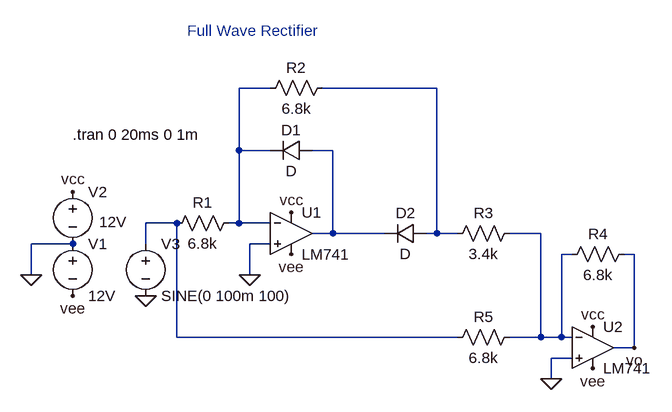
[diagram p0: schematic full_wave_rectifier.asc]
full_wave_rectifier.asc, the LTspice schematic file:
Version 4.1
SHEET 1 916 680
WIRE 320 -64 272 -64
WIRE 576 -64 400 -64
WIRE 272 32 272 -64
WIRE 320 32 272 32
WIRE 416 32 384 32
WIRE 176 144 128 144
WIRE 272 144 272 32
WIRE 272 144 256 144
WIRE 320 144 272 144
WIRE 416 160 416 32
WIRE 416 160 384 160
WIRE 496 160 416 160
WIRE 576 160 576 -64
WIRE 576 160 560 160
WIRE 608 160 576 160
WIRE 736 160 688 160
WIRE 16 176 -48 176
WIRE 128 176 128 144
WIRE 320 176 288 176
WIRE 784 192 768 192
WIRE 880 192 864 192
WIRE -48 224 -48 176
WIRE 288 224 288 176
WIRE 176 320 176 144
WIRE 608 320 176 320
WIRE 736 320 736 160
WIRE 736 320 688 320
WIRE 768 320 768 192
WIRE 768 320 736 320
WIRE 784 320 768 320
WIRE 880 336 880 192
WIRE 880 336 848 336
WIRE 784 352 752 352
WIRE 752 384 752 352
FLAG -48 224 0
FLAG 16 96 vcc
FLAG 16 256 vee
FLAG 752 384 0
FLAG 128 256 0
FLAG 880 336 vo
FLAG 288 224 0
FLAG 352 128 vcc
FLAG 352 192 vee
FLAG 816 304 vcc
FLAG 816 368 vee
SYMBOL voltage 16 160 R0
WINDOW 123 0 0 Left 0
WINDOW 39 0 0 Left 0
SYMATTR InstName V1
SYMATTR Value 12V
SYMBOL voltage 16 80 R0
WINDOW 3 41 62 Left 2
WINDOW 123 0 0 Left 0
WINDOW 39 0 0 Left 0
SYMATTR InstName V2
SYMATTR Value 12V
SYMBOL LM741 352 96 R0
SYMATTR InstName U1
SYMBOL LM741 816 272 R0
SYMATTR InstName U2
SYMBOL diode 384 16 R90
WINDOW 0 0 32 VBottom 2
WINDOW 3 32 32 VTop 2
SYMATTR InstName D1
SYMBOL diode 560 144 R90
WINDOW 0 0 32 VBottom 2
WINDOW 3 32 32 VTop 2
SYMATTR InstName D2
SYMBOL res 272 128 R90
WINDOW 0 0 56 VBottom 2
WINDOW 3 32 56 VTop 2
SYMATTR InstName R1
SYMATTR Value 6.8k
SYMBOL res 416 -80 R90
WINDOW 0 0 56 VBottom 2
WINDOW 3 32 56 VTop 2
SYMATTR InstName R2
SYMATTR Value 6.8k
SYMBOL res 704 144 R90
WINDOW 0 0 56 VBottom 2
WINDOW 3 32 56 VTop 2
SYMATTR InstName R3
SYMATTR Value 3.4k
SYMBOL res 880 176 R90
WINDOW 0 0 56 VBottom 2
WINDOW 3 32 56 VTop 2
SYMATTR InstName R4
SYMATTR Value 6.8k
SYMBOL res 704 304 R90
WINDOW 0 0 56 VBottom 2
WINDOW 3 32 56 VTop 2
SYMATTR InstName R5
SYMATTR Value 6.8k
SYMBOL voltage 128 160 R0
WINDOW 123 0 0 Left 0
WINDOW 39 0 0 Left 0
SYMATTR InstName V3
SYMATTR Value SINE(0 100m 100)
TEXT 16 8 Left 2 !.tran 0 20ms 0 1m
TEXT 192 -152 Left 2 ;Full Wave Rectifier

The netlist it stands for:
* full_wave_rectifier.asc
V1 0 vee 12V
V2 vcc 0 12V
X§U1 0 N001 vcc vee N003 LM741  ; pins In+ In- V+ V- OUT
X§U2 0 N005 vcc vee vo LM741  ; pins In+ In- V+ V- OUT
D1 N003 N001 D
D2 N002 N003 D
R1 N001 N004 6.8k
R2 N002 N001 6.8k
R3 N005 N002 3.4k
R4 vo N005 6.8k
R5 N005 N004 6.8k
V3 N004 0 SINE(0 100m 100)
.model D D
.lib standard.dio
.tran 0 20ms 0 1m
* Full Wave Rectifier
.lib LM741.lib
.backanno
.end